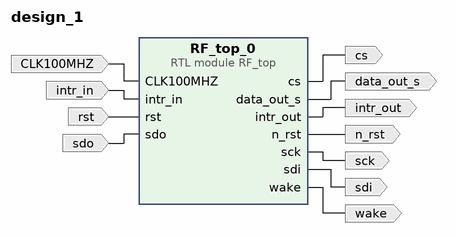
[diagram p0: block diagram of the top level]
# Vivado block design design_1, xc7a100tcsg324-1, Vivado 2023.2
create_bd_design design_1

create_bd_port -dir I -type clk CLK100MHZ
set_property -dict {CONFIG.FREQ_HZ 100000000} [get_bd_ports CLK100MHZ]
create_bd_port -dir I -type data sdo
create_bd_port -dir I -type intr intr_in
create_bd_port -dir O -type data sdi
create_bd_port -dir O -type clk sck
create_bd_port -dir O -type data cs
create_bd_port -dir O -type data data_out_s
create_bd_port -dir O -type intr intr_out
create_bd_port -dir O wake
create_bd_port -dir I -type rst rst
set_property -dict {CONFIG.POLARITY ACTIVE_HIGH} [get_bd_ports rst]
create_bd_port -dir O -type rst n_rst

create_bd_cell -type module -reference RF_top RF_top_0

# ---- connections ----

connect_bd_net [get_bd_ports CLK100MHZ] [get_bd_pins RF_top_0/CLK100MHZ]
connect_bd_net [get_bd_pins RF_top_0/cs] [get_bd_ports cs]
connect_bd_net [get_bd_pins RF_top_0/data_out_s] [get_bd_ports data_out_s]
connect_bd_net [get_bd_pins RF_top_0/intr_out] [get_bd_ports intr_out]
connect_bd_net [get_bd_pins RF_top_0/n_rst] [get_bd_ports n_rst]
connect_bd_net [get_bd_pins RF_top_0/sck] [get_bd_ports sck]
connect_bd_net [get_bd_pins RF_top_0/sdi] [get_bd_ports sdi]
connect_bd_net [get_bd_pins RF_top_0/wake] [get_bd_ports wake]
connect_bd_net [get_bd_ports intr_in] [get_bd_pins RF_top_0/intr_in]
connect_bd_net [get_bd_ports rst] [get_bd_pins RF_top_0/rst]
connect_bd_net [get_bd_ports sdo] [get_bd_pins RF_top_0/sdo]

validate_bd_design
save_bd_design
